# Altium schematic sheet SDCard.SchDoc
size A4; Date: Date; CompanyName: HESSO; Engineer: Name; Address1: Route du Rawyl 47; Address2: 1950 Sion; Address3: Switzerland; DocumentNumber: 2; SheetNumber: 2; SheetTotal: 4; ProjectName: Project Name
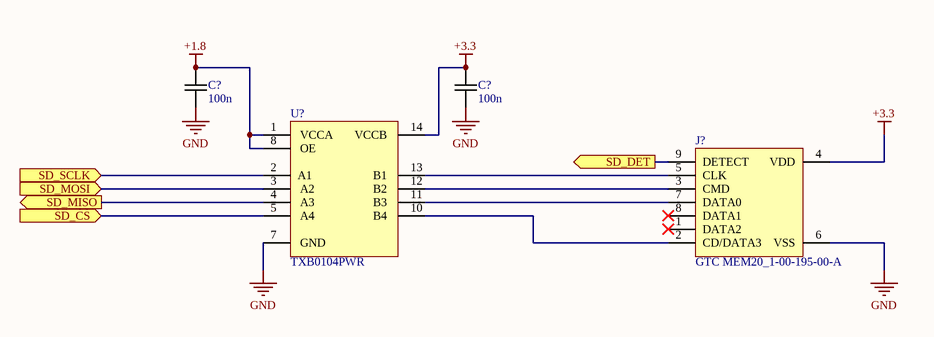
[diagram p0: SDCard.SchDoc]

## Parts
(Parts that share a designator on the sheet are numbered #1, #2 ... from top to bottom, then left to right.)
C?#1  100n  [CAPACITOR 1608 REFLOW]
C?#2  100n  [CAPACITOR 1608 REFLOW]
J?  GTC MEM20_1-00-195-00-A  [SD MICRO GCT MEM2051-00-195-00-A]
U?  TXB0104PWR  [TSSOP14 P0.65 C4.4x5.0 H1.1]

## Ports
SD_CS (in), SD_DET (out), SD_MISO (out), SD_MOSI (in), SD_SCLK (in)

## Nets
+1.8: C?#1.2 U?.1(VCCA) U?.8(OE)
+3.3: C?#2.2 J?.4(VDD) U?.14(VCCB)
GND: C?#1.1 C?#2.1 J?.6(VSS) U?.7(GND)
SD_CS: U?.5(A4) ; port SD_CS
SD_DET: J?.9(DETECT) ; port SD_DET
SD_MISO: U?.4(A3) ; port SD_MISO
SD_MOSI: U?.3(A2) ; port SD_MOSI
SD_SCLK: U?.2(A1) ; port SD_SCLK
NetJ?_2: J?.2(CD/DATA3) U?.10(B4)
NetJ?_3: J?.3(CMD) U?.12(B2)
NetJ?_5: J?.5(CLK) U?.13(B1)
NetJ?_7: J?.7(DATA0) U?.11(B3)

Not connected (* = marked no-connect by the designer): J? 1(DATA2)* 8(DATA1)*

## Notes on the sheet
- Date :
- Revision :
- Sheet
- of
- Design by :

## Library data of the parts
C?#1 C?#2 = Capacitor: Value: *
J? = SD-MICRO GTC MEM20_1-00-195-00-A: SD Card Micro; MF: Global Connector Technology; MP: MEM2051-00-195-00-A; Purchase-URL: https://pricing.snapeda.com/search/part/MEM2051-00-195-00-A/?ref=eda; Price: None; SnapEDA_Link: https://www.snapeda.com/parts/MEM2051-00-195-00-A/Global%20Connector%20Technology/view-part/779220/?ref=snap; Check_prices: https://www.snapeda.com/parts/MEM2051-00-195-00-A/Global%20Connector%20Technology/view-part/779220/?ref=eda; Package: None; Value: GTC MEM20_1-00-195-00-A; Availability: Warning
U? = TXB0104PWR: 4-Bit Bidirectional Voltage-Level Translator With utomatic Direction Sensing and ±15-kV ESD Protection; Value: TXB0104PWR